# Altium project Capstone Power Supply.PrjPcb
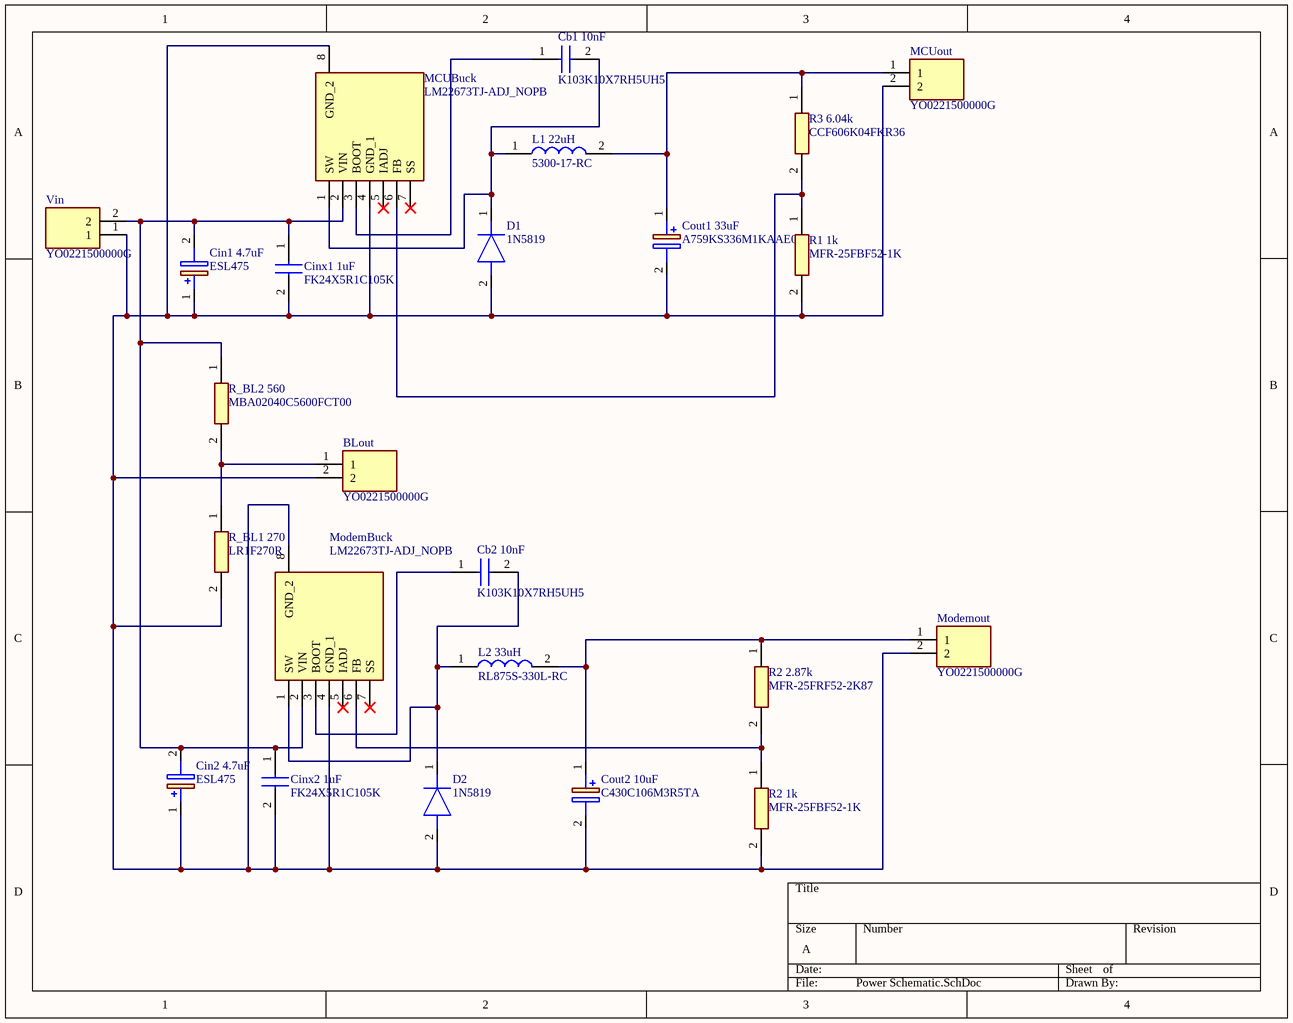
[diagram p0: Power Schematic.SchDoc]
1 sheet, 24 parts. Net scope: global (net labels, ports and power ports of the same name join across sheets).
Board file: CapstonePCB.PcbDoc

## Sheet Power Schematic.SchDoc
size A; SheetNumber: 1; SheetTotal: 1

### Parts
BLout  YO0221500000G  [YO0221500000G]
Cb1_10nF  K103K10X7RH5UH5  [K103K10X7RH5UH5]
Cb2_10nF  K103K10X7RH5UH5  [K103K10X7RH5UH5]
Cin1_4.7uF  ESL475  [CAPPRD350W60D800H1350]
Cin2_4.7uF  ESL475  [CAPPRD350W60D800H1350]
Cinx1_1uF  FK24X5R1C105K  [FK24X5R1C105K]
Cinx2_1uF  FK24X5R1C105K  [FK24X5R1C105K]
Cout1_33uF  A759KS336M1KAAE055  [CAPPRD350W65D800H1300]
Cout2_10uF  C430C106M3R5TA  [CAPPA2134W54L610D381]
D1  1N5819  [DIOAD1414W86L464D238]
D2  1N5819  [DIOAD1414W86L464D238]
L1_22uH  5300-17-RC  [INDAD2894W51L1270D406]
L2_33uH  RL875S-330L-RC  [RL875S330LRC]
MCUBuck  LM22673TJ-ADJ_NOPB  [LM22673TJADJNOPB]
MCUout  YO0221500000G  [YO0221500000G]
ModemBuck  LM22673TJ-ADJ_NOPB  [LM22673TJADJNOPB]
Modemout  YO0221500000G  [YO0221500000G]
R1_1k  MFR-25FBF52-1K  [RESAD1590W60L630D240]
R2_1k  MFR-25FBF52-1K  [RESAD1590W60L630D240]
R2_2.87k  MFR-25FRF52-2K87  [RESAD1590W60L630D240]
R3_6.04k  CCF606K04FKR36  [RESAD2428W69L1016D353]
R_BL1_270  LR1F270R  [RESAD1540W55L620D230]
R_BL2_560  MBA02040C5600FCT00  [RESAD1000W50L360D160]
Vin  YO0221500000G  [YO0221500000G]

### Nets
NetBLout_1: BLout.1 R_BL1_270.1 R_BL2_560.2
NetBLout_2: BLout.2 Cin1_4.7uF.1(+) Cin2_4.7uF.1(+) Cinx1_1uF.2 Cinx2_1uF.2 Cout1_33uF.2(-) Cout2_10uF.2(-) D1.2(A) D2.2(A) MCUBuck.4(GND_1) MCUBuck.8(GND_2) MCUout.2 ModemBuck.4(GND_1) ModemBuck.8(GND_2) Modemout.2 R1_1k.2 R2_1k.2 R_BL1_270.2 Vin.1
NetCb1_10nF_1: Cb1_10nF.1 MCUBuck.3(BOOT)
NetCb1_10nF_2: Cb1_10nF.2 D1.1(K) L1_22uH.1 MCUBuck.1(SW)
NetCb2_10nF_1: Cb2_10nF.1 ModemBuck.3(BOOT)
NetCb2_10nF_2: Cb2_10nF.2 D2.1(K) L2_33uH.1 ModemBuck.1(SW)
NetCin1_4.7uF_2: Cin1_4.7uF.2(-) Cin2_4.7uF.2(-) Cinx1_1uF.1 Cinx2_1uF.1 MCUBuck.2(VIN) ModemBuck.2(VIN) R_BL2_560.1 Vin.2
NetCout1_33uF_1: Cout1_33uF.1(+) L1_22uH.2 MCUout.1 R3_6.04k.1
NetCout2_10uF_1: Cout2_10uF.1(+) L2_33uH.2 Modemout.1 R2_2.87k.1
NetMCUBuck_6: MCUBuck.6(FB) R1_1k.1 R3_6.04k.2
NetModemBuck_6: ModemBuck.6(FB) R2_1k.1 R2_2.87k.2

Not connected (* = marked no-connect by the designer): MCUBuck 5(IADJ)* 7(SS)*; ModemBuck 5(IADJ)* 7(SS)*

### Library data of the parts
BLout MCUout Modemout Vin = YO0221500000G: Connector; Manufacturer_Name: Amphenol; Datasheet Link: https://www.mouser.in/datasheet/2/18/1/uQoNqMD3_kt_-1378971.pdf; Height: 8.8mm; Manufacturer_Part_Number: YO0221500000G; Mouser Part Number: N/A; Mouser Price/Stock: https://www.mouser.co.uk/ProductDetail/Amphenol/YO0221500000G?qs=Mv7BduZupUgHRCOAPlI3Pg%3D%3D; Arrow Part Number: YO0221500000G; Arrow Price/Stock: https://www.arrow.com/en/products/yo0221500000g/amphenol?region=nac
Cb1_10nF Cb2_10nF = K103K10X7RH5UH5: Capacitor; Manufacturer_Name: Vishay; Datasheet Link: http://www.vishay.com/docs/45171/kseries.pdf; Height: 6.2mm; Manufacturer_Part_Number: K103K10X7RH5UH5; Mouser Part Number: 594-K103K10X7RH5UH5; Mouser Price/Stock: https://www.mouser.co.uk/ProductDetail/Vishay-BC-Components/K103K10X7RH5UH5?qs=G7Q6MbuZsRNVX4vSrFkc%2FQ%3D%3D; Arrow Part Number: K103K10X7RH5UH5; Arrow Price/Stock: https://www.arrow.com/en/products/k103k10x7rh5uh5/vishay
Cin1_4.7uF Cin2_4.7uF = ESL475M250AGMAA: Capacitor Polarised; Manufacturer_Name: KEMET; Datasheet Link: https://www.kemet.com/specsheet/ESL475M250AGMAA; Height: 13.5mm; Manufacturer_Part_Number: ESL475M250AGMAA; Mouser Part Number: 80-ESL475M250AGMAA; Mouser Price/Stock: https://www.mouser.co.uk/ProductDetail/KEMET/ESL475M250AGMAA?qs=Wj%2FVkw3K%252BMD08iqDam2dkw%3D%3D
Cinx1_1uF Cinx2_1uF = FK24X5R1C105K: Capacitor; Manufacturer_Name: TDK; Datasheet Link: https://www.mouser.in/datasheet/2/400/eadmlcc_conventional_fk_en-844010.pdf; Height: 5.5mm; Manufacturer_Part_Number: FK24X5R1C105K; Mouser Part Number: 810-FK24X5R1C105K; Mouser Price/Stock: https://www.mouser.co.uk/ProductDetail/TDK/FK24X5R1C105K?qs=zLBlM7QTTNopqsz3hecOzQ%3D%3D
Cout1_33uF = A759KS336M1KAAE055: Capacitor Polarised; Manufacturer_Name: KEMET; Datasheet Link: https://connect.kemet.com:7667/gateway/IntelliData-ComponentDocumentation/1.0/download/specsheet/A759KS336M1KAAE055; Height: 13mm; Manufacturer_Part_Number: A759KS336M1KAAE055; Mouser Part Number: 80-A759KS336M1KAAE55; Mouser Price/Stock: https://www.mouser.com/Search/Refine.aspx?Keyword=80-A759KS336M1KAAE55
Cout2_10uF = C430C106M3R5TA: Capacitor Polarised; Manufacturer_Name: KEMET; Datasheet Link: https://www.kemet.com/specsheet/C430C106M3R5TA; Manufacturer_Part_Number: C430C106M3R5TA
D1 D2 = 1N5819: Diode; Manufacturer_Name: STMicroelectronics; Datasheet Link: http://www.st.com/web/en/resource/technical/document/datasheet/CD00001625.pdf; Manufacturer_Part_Number: 1N5819; Mouser Part Number: 511-1N5819; Mouser Price/Stock: https://www.mouser.co.uk/ProductDetail/STMicroelectronics/1N5819?qs=G5AQjGfRJcKKUy9S%252BaTHRQ%3D%3D; Arrow Part Number: 1N5819; Arrow Price/Stock: https://www.arrow.com/en/products/1n5819/stmicroelectronics?region=europe
L1_22uH = 5300-17-RC: Inductor; Manufacturer_Name: Bourns; Datasheet Link: https://www.bourns.com/docs/Product-Datasheets/5300_series.pdf; Manufacturer_Part_Number: 5300-17-RC; Arrow Part Number: 5300-17-RC; Arrow Price/Stock: https://www.arrow.com/en/products/5300-17-rc/bourns
L2_33uH = RL875S-330L-RC: Inductor; Manufacturer_Name: Bourns; Datasheet Link: https://www.bourns.com/docs/Product-Datasheets/RL875S_series.pdf; Height: 7.5mm; Manufacturer_Part_Number: RL875S-330L-RC; Mouser Part Number: 542-RL875S-330L-RC; Mouser Price/Stock: https://www.mouser.co.uk/ProductDetail/Bourns/RL875S-330L-RC?qs=8Z3NuIkqwLsxXL7rZcgY9g%3D%3D
MCUBuck ModemBuck = LM22673TJ-ADJ_NOPB: Integrated Circuit; Manufacturer_Name: Texas Instruments; Manufacturer_Part_Number: LM22673TJ-ADJ/NOPB; Datasheet Link: https://www.ti.com/lit/ds/symlink/lm22673.pdf?HQS=dis-dk-null-digikeymode-dsf-pf-null-wwe&ts=1661919908100&ref_url=https%253A%252F%252Fwww.ti.com%252Fgeneral%252Fdocs%252Fsuppproductinfo.tsp%253FdistId%253D10%2526gotoUrl%253Dhttps%253A%252F%252Fwww.ti.com; Height: 2.25mm; Mouser Part Number: 926-LM22673TJADJNOPB; Mouser Price/Stock: https://www.mouser.com/Search/Refine.aspx?Keyword=926-LM22673TJADJNOPB; Arrow Part Number: LM22673TJ-ADJ/NOPB; Arrow Price/Stock: https://www.arrow.com/en/products/lm22673tj-adjnopb/texas-instruments
R1_1k R2_1k = MFR-25FBF52-1K: Resistor; Manufacturer_Name: KEMET; Datasheet Link: http://www.mouser.com/ds/2/447/Yageo LR_MFR_2013-467719.pdf; Manufacturer_Part_Number: MFR-25FBF52-1K; Mouser Part Number: 603-MFR-25FBF52-1K; Mouser Price/Stock: https://www.mouser.co.uk/ProductDetail/YAGEO/MFR-25FBF52-1K?qs=oAGoVhmvjhwCAC47ReWjsQ%3D%3D; Arrow Part Number: MFR-25FBF52-1K; Arrow Price/Stock: https://www.arrow.com/en/products/mfr-25fbf52-1k/yageo?region=nac
R2_2.87k = MFR-25FRF52-2K87: Resistor; Manufacturer_Name: KEMET; Datasheet Link: https://www.mouser.com/datasheet/2/447/YAGEO_MFR_datasheet_2021v1-3003041.pdf; Manufacturer_Part_Number: MFR-25FRF52-2K87; Mouser Part Number: 603-MFR-25FRF522K87; Mouser Price/Stock: https://www.mouser.co.uk/ProductDetail/Yageo/MFR-25FRF52-2K87?qs=5furm%2FeQHzRI%252BGscHIbGHg%3D%3D
R3_6.04k = CCF606K04FKR36: Resistor; Manufacturer_Name: Vishay; Datasheet Link: https://4donline.ihs.com/images/VipMasterIC/IC/VISH/VISH-S-A0001810520/VISH-S-A0001810520-1.pdf?hkey=EF798316E3902B6ED9A73243A3159BB0; Manufacturer_Part_Number: CCF606K04FKR36
R_BL1_270 = LR1F270R: Resistor; Manufacturer_Name: TE Connectivity; Datasheet Link: http://uk.rs-online.com/web/p/products/0148360A; Manufacturer_Part_Number: LR1F270R; Mouser Part Number: 279-LR1F270R; Mouser Price/Stock: https://www.mouser.com/Search/Refine.aspx?Keyword=279-LR1F270R
R_BL2_560 = MBA02040C5600FCT00: Resistor; Manufacturer_Name: Vishay; Datasheet Link: https://4donline.ihs.com/images/VipMasterIC/IC/VISH/VISH-S-A0005972005/VISH-S-A0005972005-1.pdf?hkey=EF798316E3902B6ED9A73243A3159BB0; Manufacturer_Part_Number: MBA02040C5600FCT00; Mouser Part Number: 71-MBA02040C5600FCT0; Mouser Price/Stock: https://www.mouser.co.uk/ProductDetail/Vishay-Beyschlag/MBA02040C5600FCT00?qs=ukEjfVZLQqcmmVNbpijvLA%3D%3D